# Altium schematic sheet CanTransceiver.SchDoc
size A; SheetNumber: 3; SheetTotal: 4
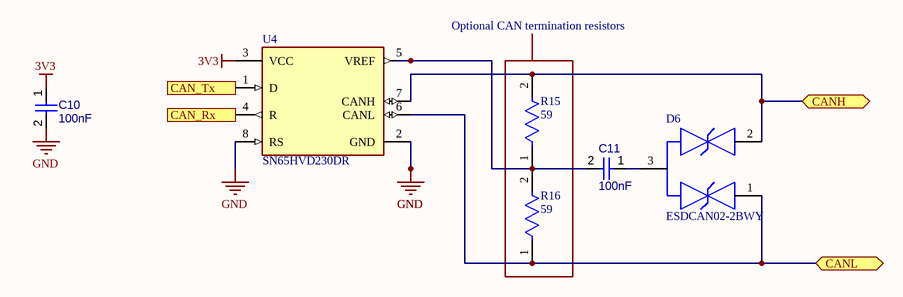
[diagram p0: CanTransceiver.SchDoc]

## Parts
C10  100nF  [CAPC0402(1005)60_L]
C11  100nF  [CAPC0402(1005)60_L]
D6  ESDCAN02-2BWY  [FP-SOT323-3L-MFG]
R15  59  [FP-CRCW0805-e3-IPC_B]
R16  59  [FP-CRCW0805-e3-IPC_B]
U4  SN65HVD230DR  [FP-D0008A-IPC_A]

## Ports
CAN_Rx (out), CAN_Tx (in), CANH (bidir), CANL (bidir)

## Nets
3V3: C10.1 U4.3(VCC)
GND: C10.2 U4.2(GND) U4.8(RS)
CAN_Rx: U4.4(R) ; port CAN_Rx
CAN_Tx: U4.1(D) ; port CAN_Tx
CANH: D6.2 R15.2 U4.7(CANH) ; port CANH
CANL: D6.1 R16.1 U4.6(CANL) ; port CANL
NetC11_1: C11.1 D6.3
NetC11_2: C11.2 R15.1 R16.2 U4.5(VREF)

## Notes on the sheet
- Optional CAN termination resistors

## Library data of the parts
C10 C11 = CMP-001-00061-2: Chip Capacitor, 100nF +/-20%, 10V, 0402, Thickness 0.6 mm; Tolerance: 20%; Max Operating Temperature: 85°C; Min Operating Temperature: -55°C; Voltage Rating: 10V; Case/Package: 0402; Mounting Technology: SMT; Pins: 2; Value: 100nF
D6 = CMP-12225-000055-1: TVS DIODE 26.5V 44V SOT323-3; Manufacturer: STMicroelectronics; Value: 3pF; Direction: Bidirectional; Breakdown Voltage: 28.5V; Automotive Grade: Grade 0; Standoff Height: 0mm; Peak Pulse Power: 170W; Peak Pulse Current: 3A; Number Of Channels: 2; Max Junction Temp: +175°C; Mouser Description: TVS Diodes / ESD Suppressors Automotive dual-line Transil, Transient voltage suppressor (TVS) for CAN bus; Height: 1.1mm; Category: Diode; Reverse Standoff Voltage: 26.5V; Device Class L1: Circuit Protection; Temperature: -55°C to +175°C; RoHS: TRUE; ComponentLink2URL: https://www.st.com/resource/en/datasheet/esdcan02-2bwy.pdf; Device Class L3: unset; Device Class L2: TVS Diodes; Temperature Range High: +175°C; Octopart: https://octopart.com/esdcan02-2bwy-stmicroelectronics-58631133; Ipc Land Pattern Name: SOT65P210X95-3; Temperature Range Low: -55°C; Capacitance: 3pF; Digikey Description: TVS DIODE 26.5V 44V SOT323-3; Automotive: Yes; ComponentLink2Description: Datasheet; Clamping Voltage: 44V; Manufacturer Part Number: ESDCAN02-2BWY; Lead Free: Yes; Package: SOT323-3L
R15 R16 = CMP-02407-002414-1: RES Thick Film, 59Ω, 1%, 0.125W, 100ppm/°C, 0805; Power Rating: 125mW; Voltage Rating (DC): 150V; Resistance: 59R; Length: 2mm; Mount: Surface Mount; Military Standard: Not; Min Operating Temperature: -55°C; Number of Pins: 2; Height: 0.02inch; Weight: 0.000194oz; Case Code (Metric): 2012; Features: Automotive AEC-Q200; Width: 1.25mm; Tolerance: 1%; Max Operating Temperature: 155°C; Temperature Coefficient: 100ppm/°C; Depth: 1.25mm; Termination: SMD/SMT; Package Quantity: 10; Number of Terminations: 2; Packaging: Tape and Reel; Radiation Hardening: No; Composition: Thick Film; Lead Free: Lead Free; Case Code (Imperial): 0805; Case/Package: 0805; Contact Plating: Tin; Max Power Dissipation: 125mW; Voltage Rating: 150V
U4 = CMP-0315-00015-3: IC TRANSCEIVER HALF 1/1 8SOIC; Number of Transceivers: 1; Operating Supply Voltage: 3.3V; Number of I/Os: 2; Max Supply Current: 17mA; Max Supply Voltage: 3.6V; Min Supply Voltage: 3V; Data Rate: 1Mbps; Min Operating Temperature: -40°C; Packaging: Tape and Reel; Lead Free: Lead Free; Number of Transmit Buffers: 1; Max Operating Temperature: 85°C; Number of Receive Buffers: 1; Number of Pins: 8; Package Quantity: 1; Radiation Hardening: No; Case/Package: D; REACH SVHC: No SVHC; Weight: 0.002561oz; Termination: SMD/SMT; Contact Plating: Gold; Nominal Supply Current: 17mA; Number of Receivers: 1; Number of Drivers: 1